# Altium schematic sheet PP_0_3.SchDoc: Плата распределения
size 420 x 297 mm; PageSetup: Record=PageOptions|CenterHorizontal=True|CenterVertical=True|PrintScale=0.94|XCorrection=1.00|YCorrection=1.00|PrintKind=2|BorderSize=5000000|LeftOffset=0|BottomOffset=0|Orientation=1|PaperLength=2970|PaperWidth=2100|Scale=100|PaperSource=7|PrintQuality=600|MediaType=1|DitherType=10|PaperKind=A4|PrintScaleMode=1; Date: 27.03.21; ApprovedBy: Ярмолинская; CheckedBy: Ярмолинская; DrawnBy: Ярмолинский; DocumentNumber: 53251498.468331.01.01.00 Э3; Revision: 1; SheetTotal: 1; Title1str: питания; DocumentType: Схема электрическая принципиальная; Format: A3; ImagePath: Введите номер платы
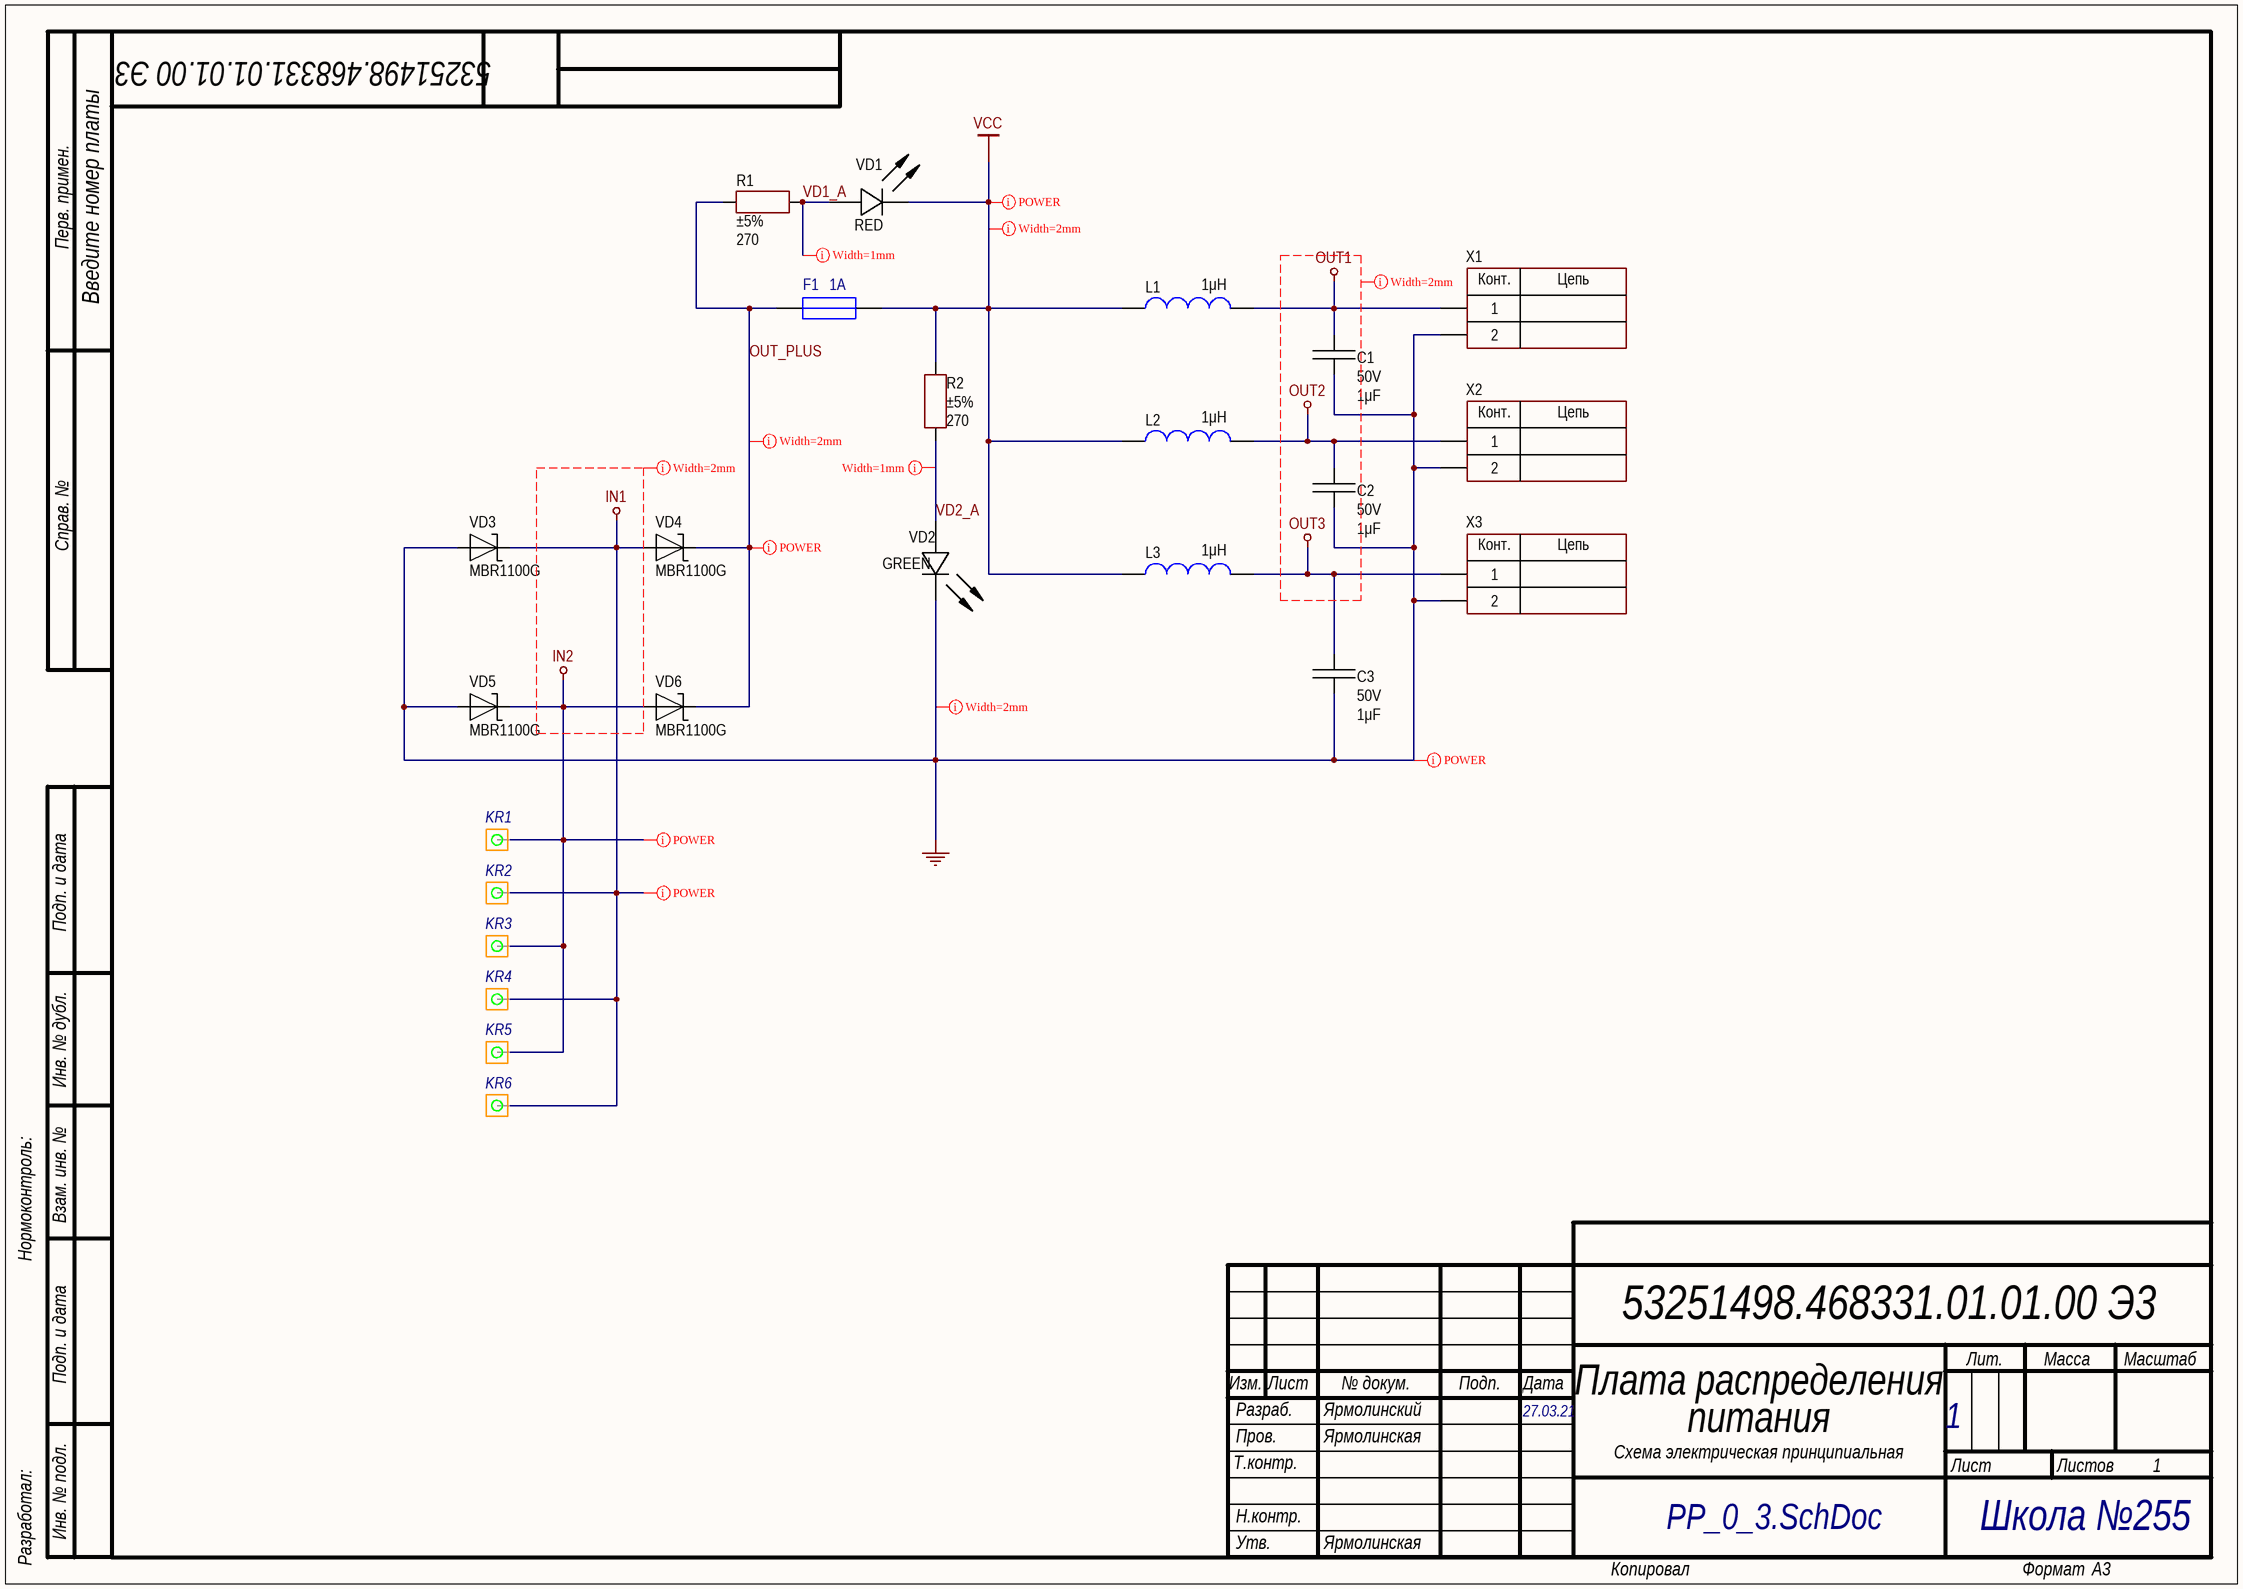
[diagram p0: PP_0_3.SchDoc]

## Parts
C1  value 1μF  Voltage: 50V  [CAP: 0805, Thru-Hole]
C2  value 1μF  Voltage: 50V  [CAP: 0805, Thru-Hole]
C3  value 1μF  Voltage: 50V  [CAP: 0805, Thru-Hole]
F1  value 1A  [MF-R_Style_1]  (hidden comment: Fuse 1A)
KR1  KR_3  [KR_3_0]  (value not drawn)
KR2  KR_3  [KR_3_0]  (value not drawn)
KR3  KR_3  [KR_3_0]  (value not drawn)
KR4  KR_3  [KR_3_0]  (value not drawn)
KR5  KR_3  [KR_3_0]  (value not drawn)
KR6  KR_3  [KR_3_0]  (value not drawn)
L1  value 1μH  [IND: BL-01]
L2  value 1μH  [IND: BL-01]
L3  value 1μH  [IND: BL-01]
R1  value 270  Tolerance: ±5%  [AXIAL-0.3]
R2  value 270  Tolerance: ±5%  [AXIAL-0.3]
VD1  Color: RED  [LED: 3MM_R]
VD2  Color: GREEN  [LED: 3MM_G]
VD3  PartNumber: MBR1100G  [DIODE: DO-41]
VD4  PartNumber: MBR1100G  [DIODE: DO-41]
VD5  PartNumber: MBR1100G  [DIODE: DO-41]
VD6  PartNumber: MBR1100G  [DIODE: DO-41]
X1  (no value)  [CON: DG350-3.5-02P]
X2  (no value)  [CON: DG350-3.5-02P]
X3  (no value)  [CON: DG350-3.5-02P]

## Nets
GND: C1.2 C2.1 C3.2 VD2.2(C) VD3.1 VD5.1 X1.2 X2.2 X3.2
IN1: KR2.0 KR4.0 KR6.0 VD3.2 VD4.1
IN2: KR1.0 KR3.0 KR5.0 VD5.2 VD6.1
OUT1: C1.1 L1.1 X1.1
OUT2: C2.2 L2.1 X2.1
OUT3: C3.1 L3.1 X3.1
VCC: F1.2 L1.2 L2.2 L3.2 R2.2 VD1.2(C)
OUT_PLUS: F1.1 R1.1 VD4.2 VD6.2
VD1_A: R1.2 VD1.1(A)
VD2_A: R2.1 VD2.1(A)

## Layout directives
net class Power: GND, IN1, IN2, OUT_PLUS, VCC
rule Width Constraint [Pref Width = 2mm    Min Width = 1.5mm    Max Width = 2.5mm]: GND, IN1, IN2, OUT1, OUT2, OUT3, OUT_PLUS, VCC
rule Width Constraint [Pref Width = 1mm    Min Width = 0.254mm    Max Width = 1mm]: VD1_A, VD2_A

## Notes on the sheet
- Школа №255
- Перв. примен.
- Справ. №
- Подп. и дата
- Инв. № дубл.
- Нормоконтроль:
- Взам. инв. №
- Изм.
- Лист
- № докум.
- Подп.
- Дата
- Лит.
- Масса
- Масштаб
- Т.контр.
- Пров.
- Разраб.
- Листов
- Разработал:
- Инв. № подл.
- Н.контр.
- Утв.
- Копировал
- Формат
- (in symbol Connector_terminal_2pin) Конт.; Цепь

## Library data of the parts
C1-C3 = Ceramic_0805: К10-17 0805; Manufacturer: Murata; PartNumber: RDER71H105K2K1C03B; ValueManufacturerPartNumber: Ceramic capacitor, 1μF, X7R, ±10%, 50V, 0805, -55...+125°C; TypeCapacitor: Ceramic capacitor; Tolerance: ±10%; TypeDielectric: X7R; Package: 0805; HelpURL: https://www.chipdip.ru/product0/9000238474; Temperature: -55...+125°C
  C1: ClassName: Groupe1
  C2: ClassName: Groupe2
  C3: ClassName: Groupe3
F1 = Fuse 1A: PartNumber: MF-R300; Published: 8-Jun-2000; LatestRevisionDate: 17-Jul-2002; LatestRevisionNote: Re-released for DXP Platform.; PackageReference: MF-R_Style_2; Publisher: Altium Limited; PackageDescription: Thru-Hole; 2 Leads
KR1-KR6 = KR_3: Mounting point; Parameter 1: *
L1 = IND: BL-01: Индуктивность  подавления ЭМП; Manufacturer: Murata; PartNumber: BL01RN1A2A2B; ValueManufacturerPartNumber: Fixed inductor, 1μH, ±20%, BL-01, Kool Mu, µ=125, 90 нГн/витков2; TypeInductor: Fixed inductor; TypeMatiriel: Kool Mu; AL: 90 нГн/витков2; MaterialPermeability: µ=125; Tolerance: ±20%; Package: BL-01; HelpURL: https://www.chipdip.ru/product/bl01rn1a2a2b; ClassName: Groupe1
L2 L3 = IND: BL-01: Индуктивность  подавления ЭМП; Manufacturer: Murata; PartNumber: 30201567; ValueManufacturerPartNumber: Fixed inductor, 1μH, ±20%, BL-01, Kool Mu, µ=125, 90 нГн/витков2; TypeInductor: Fixed inductor; TypeMatiriel: Kool Mu; AL: 90 нГн/витков2; MaterialPermeability: µ=125; Tolerance: ±20%; Package: BL-01; HelpURL: https://www.chipdip.ru/product/bl01rn1a2a2b
  L2: ClassName: Groupe2
  L3: ClassName: Groupe3
R1 R2 = ResistorCF-25: Manufacturer: Yageo; PartNumber: СF-1/4W-100RF; ValueManufacturerPartNumber: Resistor film, 270, ±5%, CF-25, 0.25W, -55...+125°C; TypeResistor: Resistor film; Power: 0.25W; Package: CF-25; HelpURL: https://www.digikey.com/product-detail/en/yageo/RC0201JR-07100RL/311-100NCT-ND/1949006; Temperature: -55...+125°C
VD1 = LED_single: ValueManufacturerPartNumber: LED, Red, *, *, 5mm, -55...+150°C; PartNumber: GNL-5013HT; TypeDiode: LED; Manufacturer: *; Package: 5mm; HelpURL: *; Temperature: -55...+150°C; Current: *; VoltageDrop: *; ColorParameter: Red
VD2 = LED_single: ValueManufacturerPartNumber: LED, Green, *, *, 5mm, -55...+150°C; PartNumber: GNL-5013GT; TypeDiode: LED; Manufacturer: *; Package: 5mm; HelpURL: *; Temperature: -55...+150°C; Current: *; VoltageDrop: *; ColorParameter: Green
VD3-VD6 = Schottky_1A: Manufacturer: Diodes Incorporated; ValueManufacturerPartNumber: Schottky diode, 100V, 1A, 1V, 15pF, DO-41, -55...+150°C; TypeDiode: Schottky diode; Voltage: 100V; Current: 1A; VoltageDrop: 1V; RecoveryTime: 15pF; Package: DO-41; HelpURL: https://www.digikey.com/product-detail/en/diodes-incorporated/MBR0580S1-7/MBR0580S1-7DICT-ND/5080371; Temperature: -55...+150°C; ClassName: Rectifier
X1-X3 = Connector_terminal_2pin: Manufacturer: Degson; ValueManufacturerPartNumber: Terminal connector, 2pin, 3.5mm, 300VAC, 10A; PartNumber: DG350-3.5-02P-14; TypeConnector: Terminal connector; VoltageMax: 300VAC; Pitch: 3.5mm; CurrentMax: 10A; Multichannel: 2pin; CommentText: "Разъем"; HelpURL: https://www.chipdip.ru/product/dg350-3.5-02p-12
  X1: ClassName: Groupe1
  X2: ClassName: Groupe2
  X3: ClassName: Groupe3